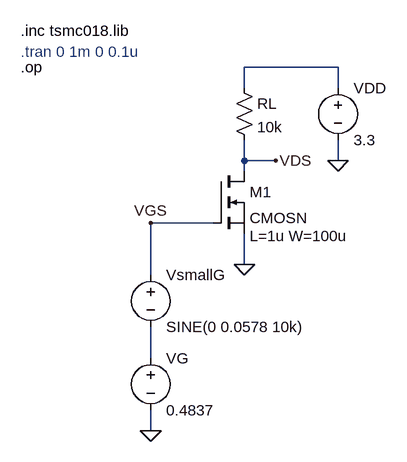
[diagram p0: schematic q1_b.asc]
q1_b.asc, the LTspice schematic file:
Version 4.1
SHEET 1 1232 680
WIRE 368 32 224 32
WIRE 224 64 224 32
WIRE 368 64 368 32
WIRE 224 176 224 144
WIRE 272 176 224 176
WIRE 368 176 368 144
WIRE 224 192 224 176
WIRE 176 272 80 272
WIRE 224 336 224 288
WIRE 80 352 80 272
WIRE 80 480 80 432
WIRE 80 592 80 560
FLAG 368 176 0
FLAG 224 336 0
FLAG 80 272 VGS
FLAG 272 176 VDS
FLAG 80 592 0
SYMBOL nmos 176 192 R0
WINDOW 123 56 100 Left 2
SYMATTR Value2 L=1u W=100u
SYMATTR InstName M1
SYMATTR Value CMOSN
SYMBOL voltage 368 48 R0
WINDOW 123 0 0 Left 0
WINDOW 39 0 0 Left 0
SYMATTR InstName VDD
SYMATTR Value 3.3
SYMBOL res 208 48 R0
SYMATTR InstName RL
SYMATTR Value 10k
SYMBOL voltage 80 464 R0
WINDOW 123 0 0 Left 0
WINDOW 39 0 0 Left 0
SYMATTR InstName VG
SYMATTR Value 0.4837
SYMBOL voltage 80 336 R0
WINDOW 123 0 0 Left 0
WINDOW 39 0 0 Left 0
SYMATTR InstName VsmallG
SYMATTR Value SINE(0 0.0578 10k)
TEXT -120 -24 Left 2 !.inc tsmc018.lib
TEXT -120 8 Left 2 ;.tran 0 1m 0 0.1u
TEXT -120 32 Left 2 !.op

The netlist it stands for:
* q1_b.asc
M1 VDS VGS 0 0 CMOSN L=1u W=100u
VDD N001 0 3.3
RL N001 VDS 10k
VG N002 0 0.4837
VsmallG VGS N002 SINE(0 0.0578 10k)
.model NMOS NMOS
.model PMOS PMOS
.lib standard.mos
.inc tsmc018.lib
* .tran 0 1m 0 0.1u
.op
.backanno
.end